# EAGLE design magarray-halleffect-v3r0 (EAGLE 8.5.1)
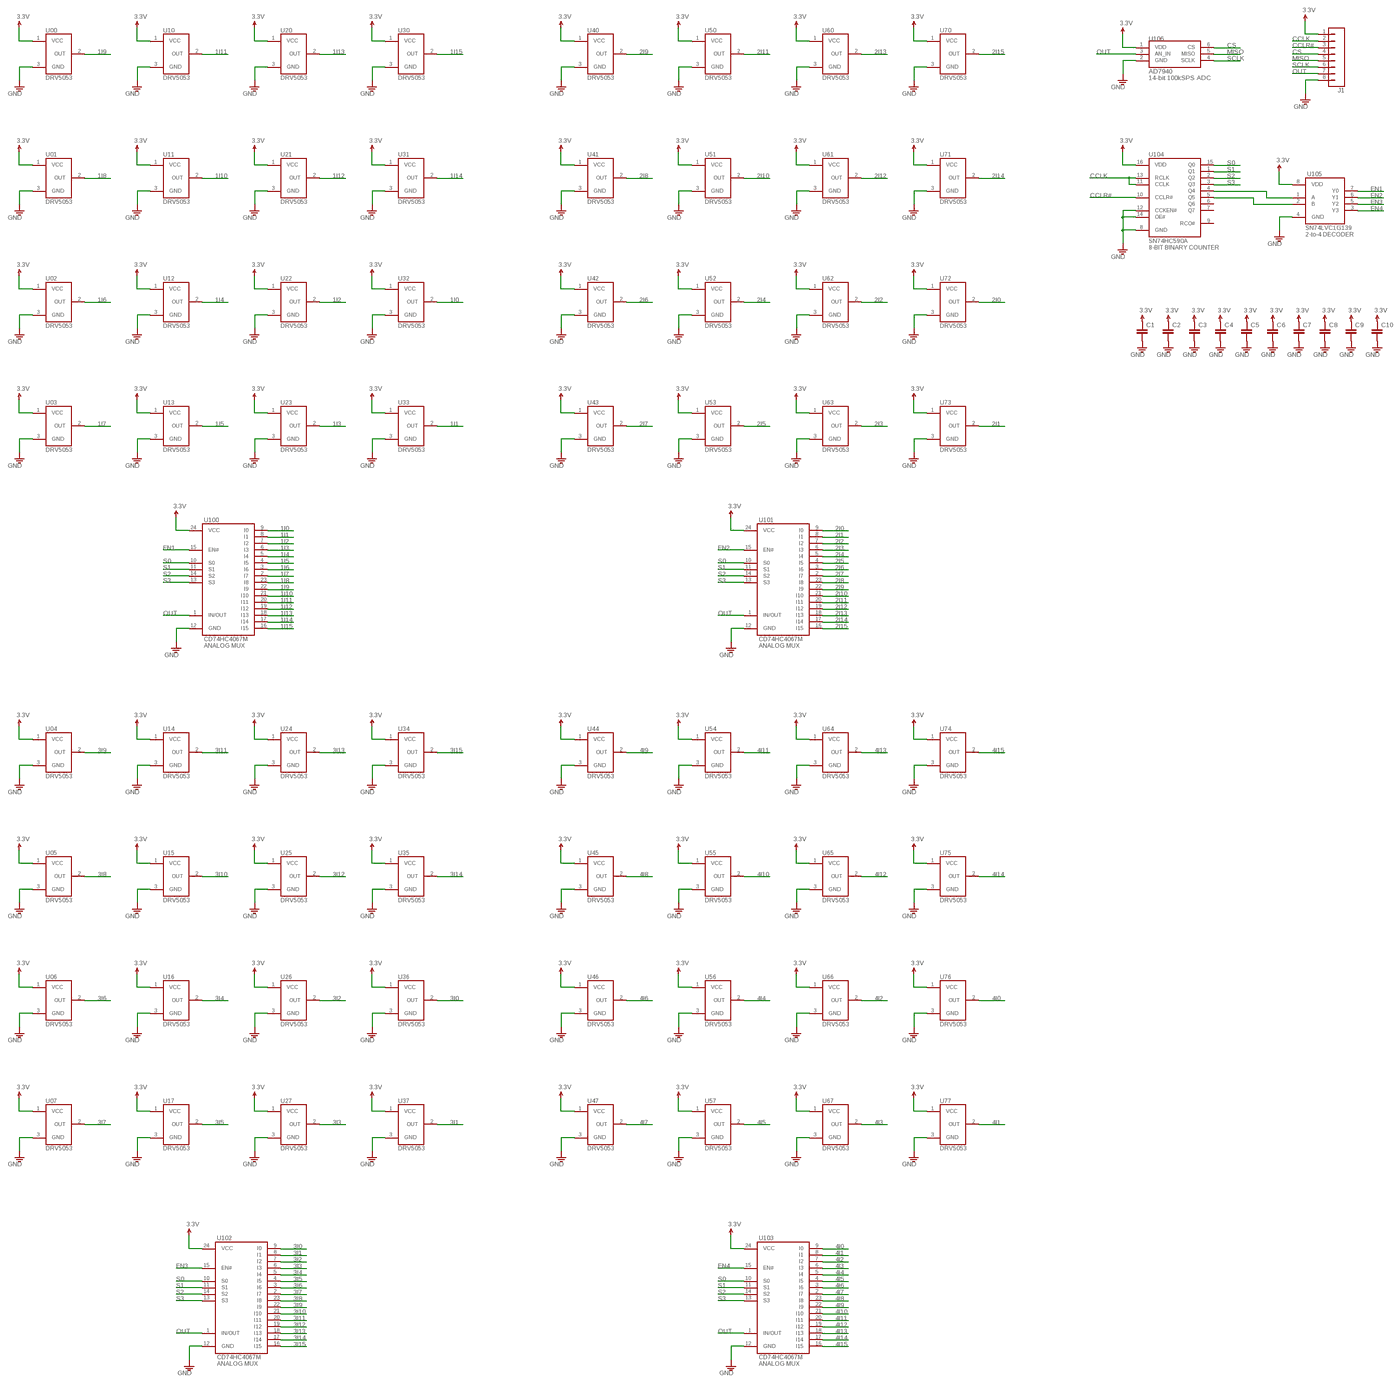
[diagram p0: schematic, sheet 1, overview]
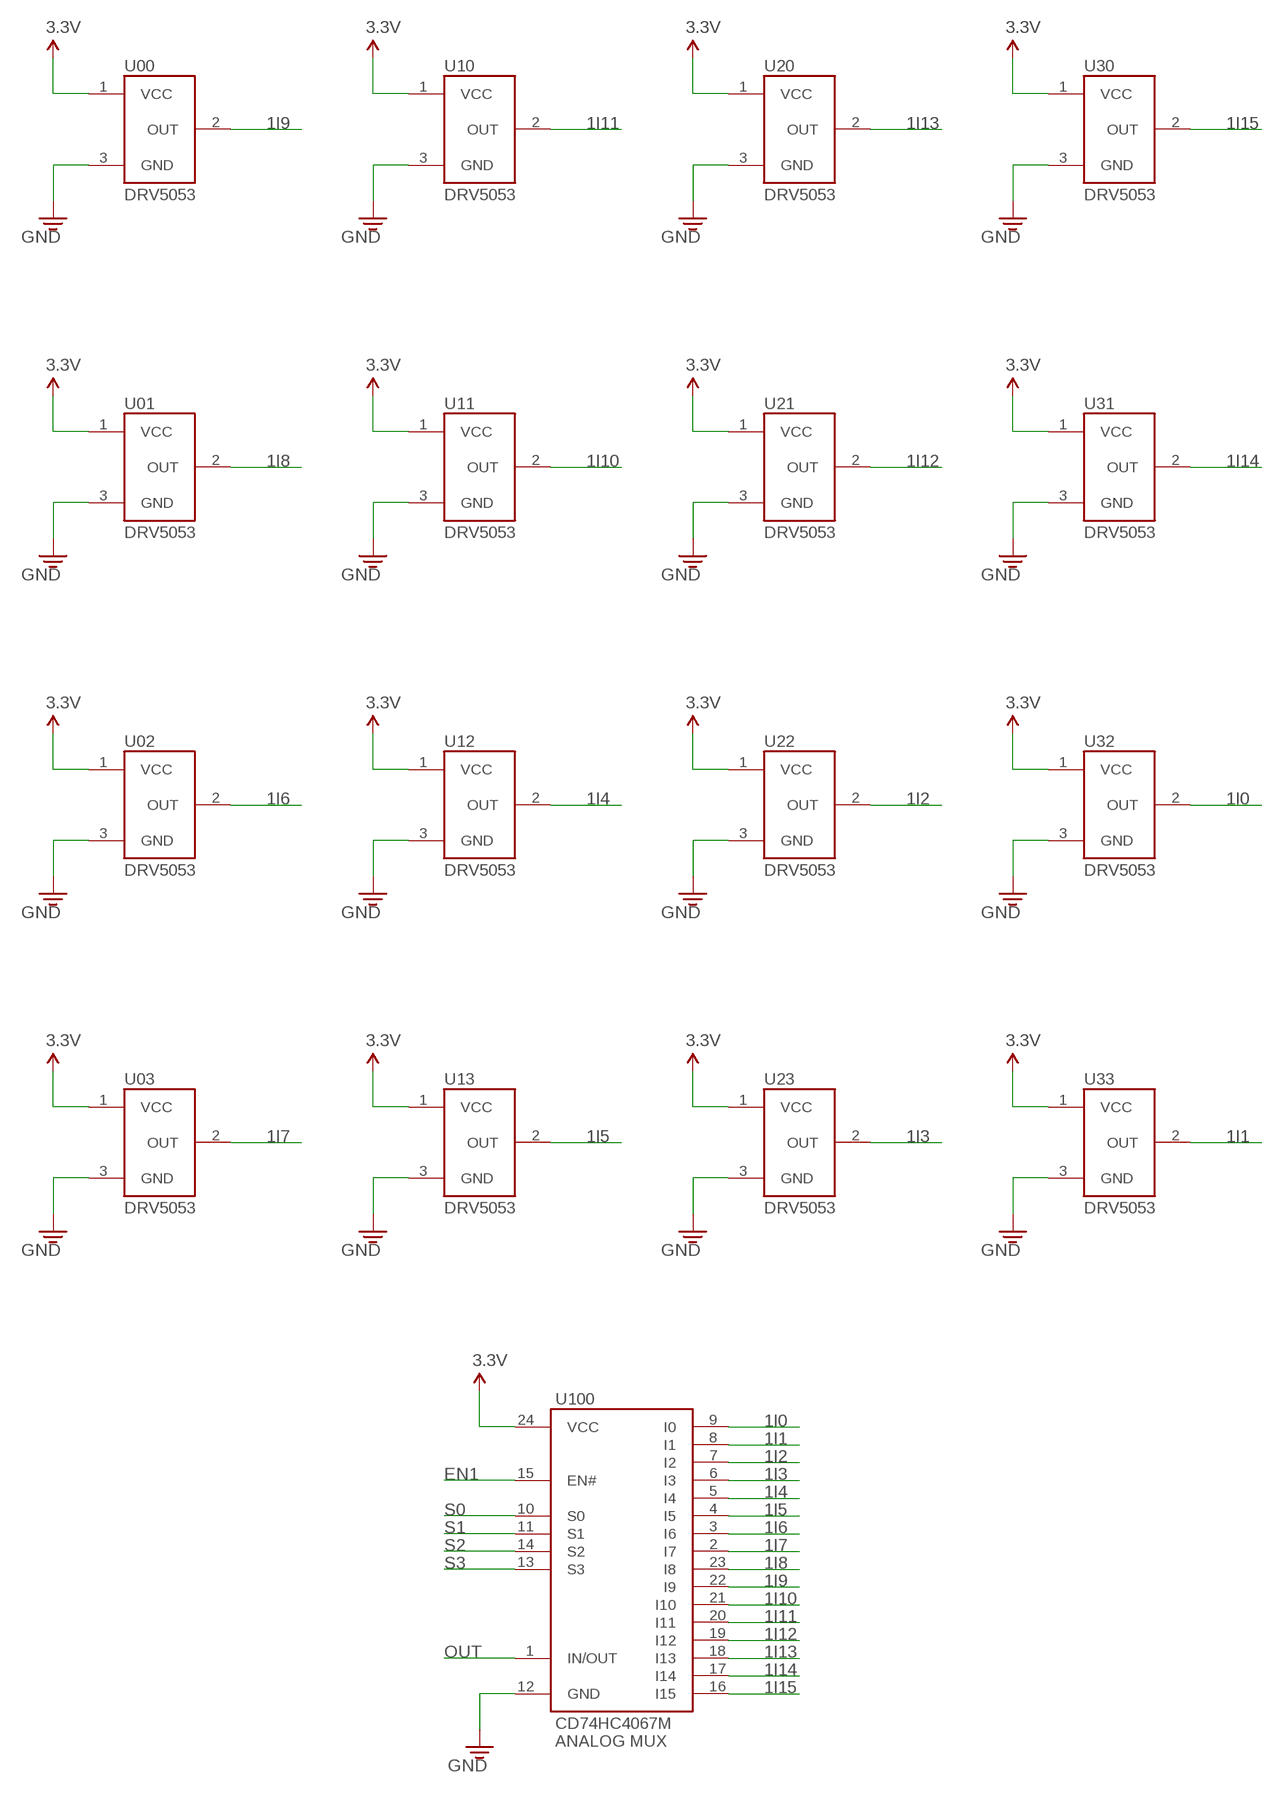
[diagram p1: schematic, sheet 1, part 1 of 4]
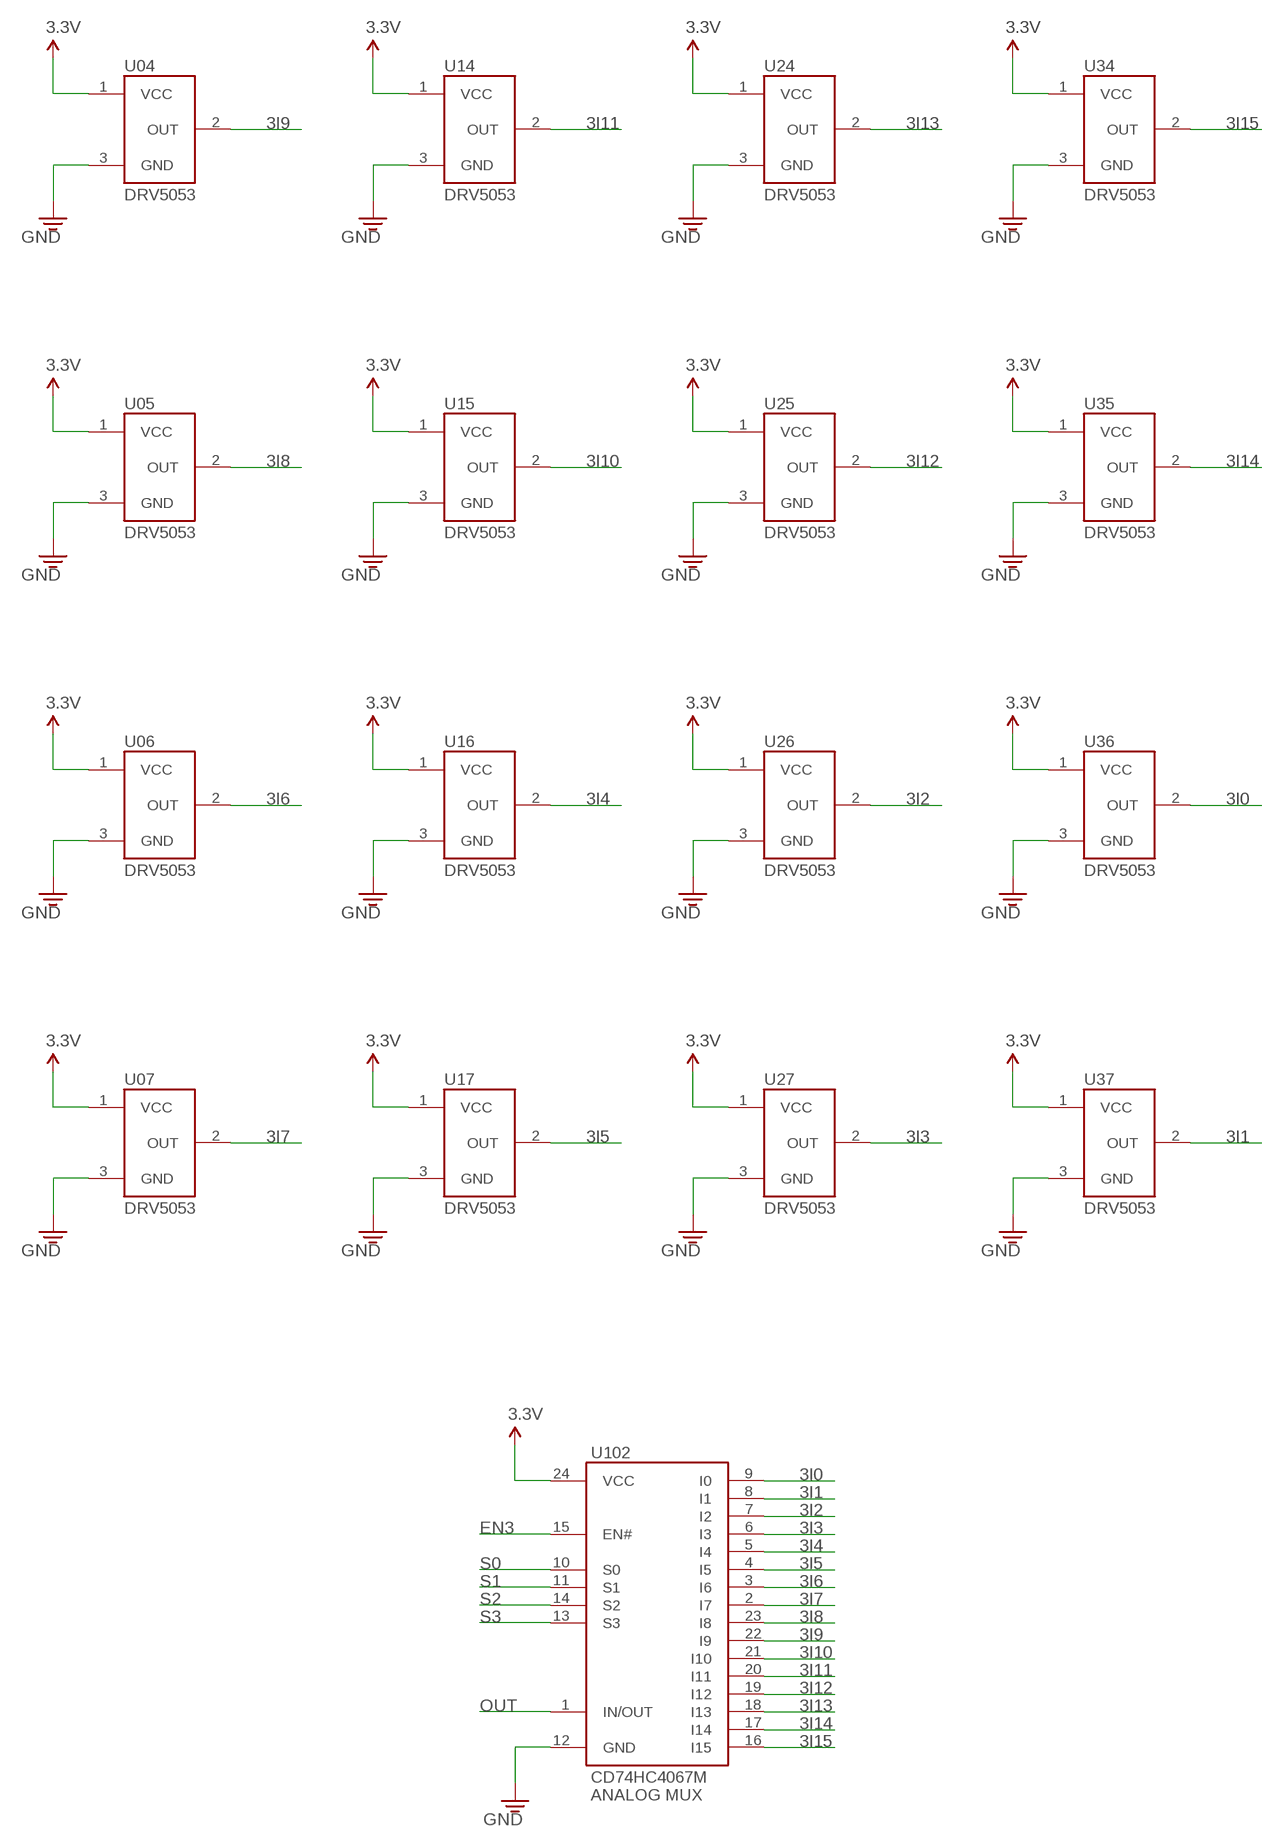
[diagram p2: schematic, sheet 1, part 2 of 4]
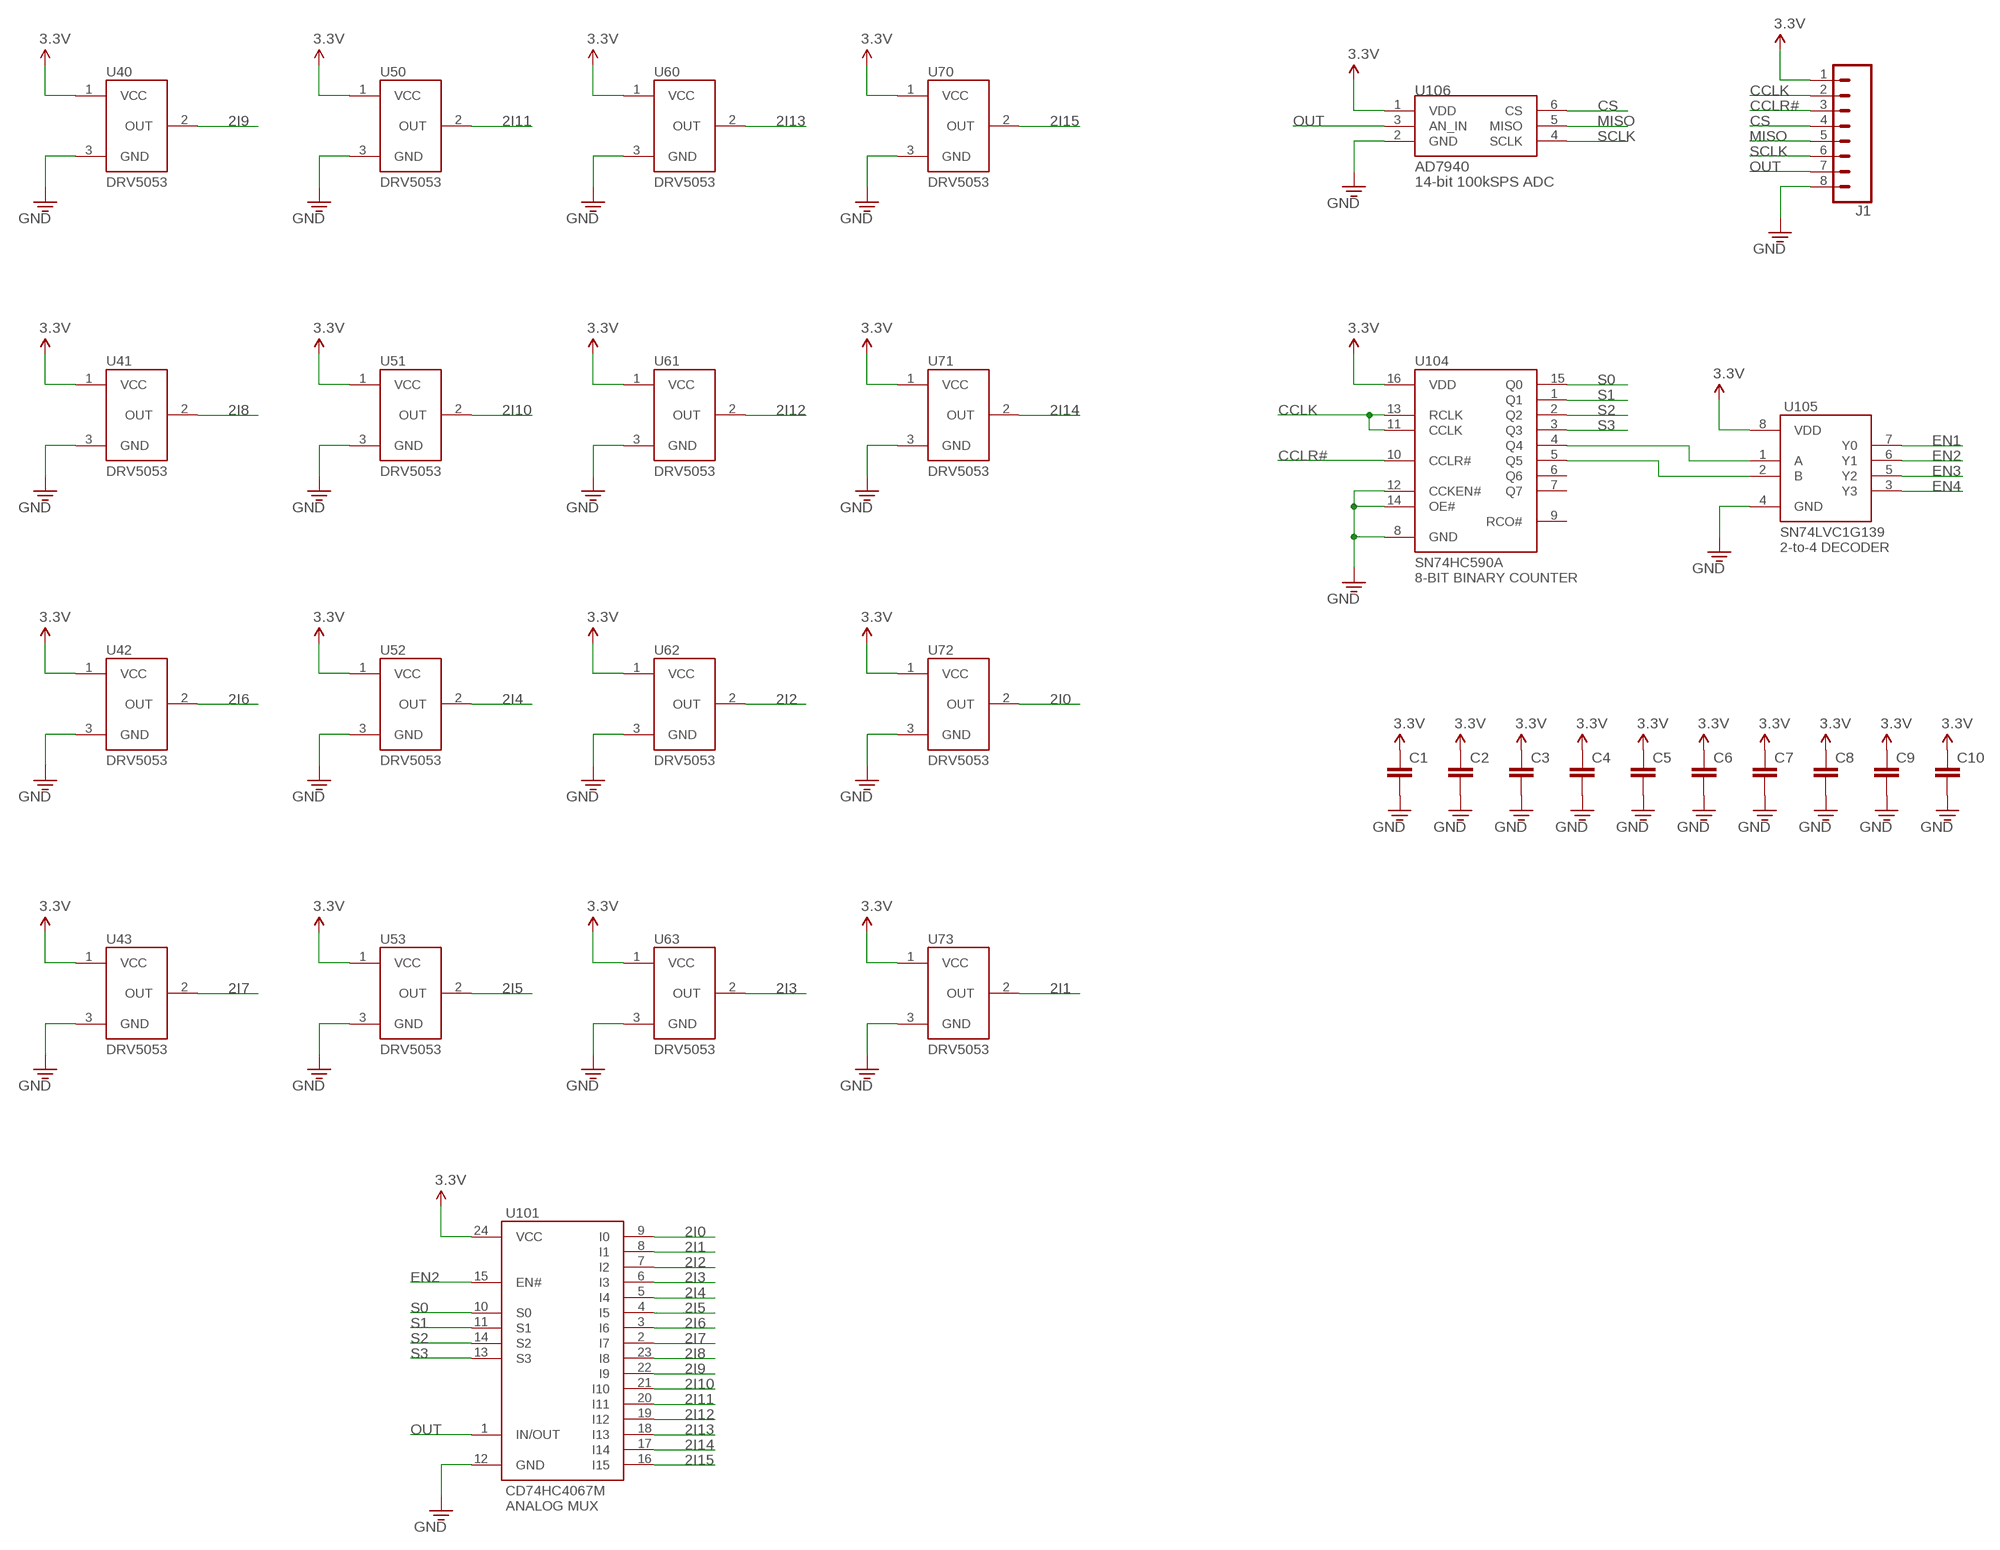
[diagram p3: schematic, sheet 1, part 3 of 4]
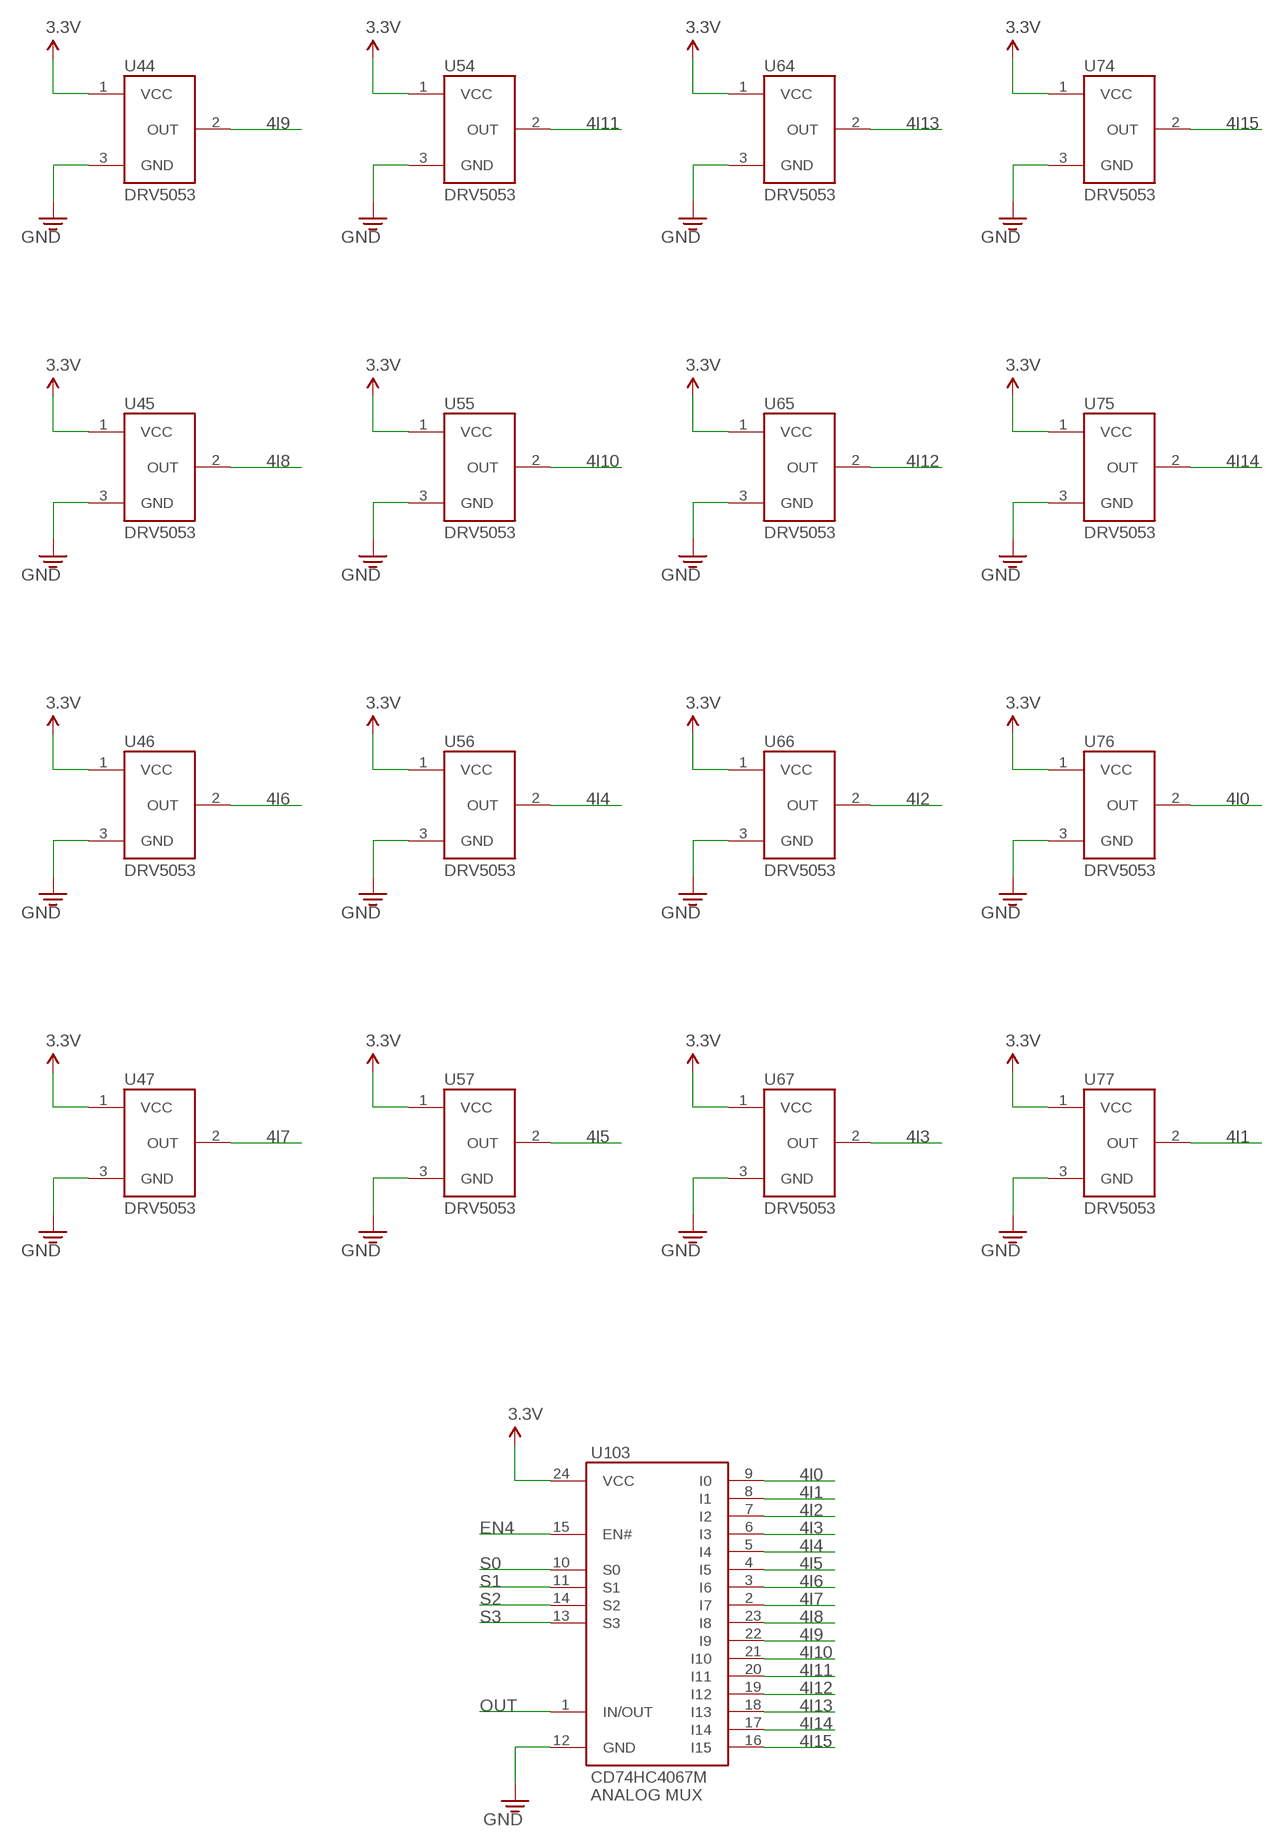
[diagram p4: schematic, sheet 1, part 4 of 4]

## Parts
C1  CAP0603  [0603]
C2  CAP0603  [0603]
C3  CAP0603  [0603]
C4  CAP0603  [0603]
C5  CAP0603  [0603]
C6  CAP0603  [0603]
C7  CAP0603  [0603]
C8  CAP0603  [0603]
C9  CAP0603  [0603]
C10  CAP0603  [0603]
J1  CONN_08LOCK_NO_SILK  [1X08_LOCK_NO_SILK]
U00  DRV5053  [SOT-23]
U01  DRV5053  [SOT-23]
U02  DRV5053  [SOT-23]
U03  DRV5053  [SOT-23]
U04  DRV5053  [SOT-23]
U05  DRV5053  [SOT-23]
U06  DRV5053  [SOT-23]
U07  DRV5053  [SOT-23]
U10  DRV5053  [SOT-23]
U11  DRV5053  [SOT-23]
U12  DRV5053  [SOT-23]
U13  DRV5053  [SOT-23]
U14  DRV5053  [SOT-23]
U15  DRV5053  [SOT-23]
U16  DRV5053  [SOT-23]
U17  DRV5053  [SOT-23]
U20  DRV5053  [SOT-23]
U21  DRV5053  [SOT-23]
U22  DRV5053  [SOT-23]
U23  DRV5053  [SOT-23]
U24  DRV5053  [SOT-23]
U25  DRV5053  [SOT-23]
U26  DRV5053  [SOT-23]
U27  DRV5053  [SOT-23]
U30  DRV5053  [SOT-23]
U31  DRV5053  [SOT-23]
U32  DRV5053  [SOT-23]
U33  DRV5053  [SOT-23]
U34  DRV5053  [SOT-23]
U35  DRV5053  [SOT-23]
U36  DRV5053  [SOT-23]
U37  DRV5053  [SOT-23]
U40  DRV5053  [SOT-23]
U41  DRV5053  [SOT-23]
U42  DRV5053  [SOT-23]
U43  DRV5053  [SOT-23]
U44  DRV5053  [SOT-23]
U45  DRV5053  [SOT-23]
U46  DRV5053  [SOT-23]
U47  DRV5053  [SOT-23]
U50  DRV5053  [SOT-23]
U51  DRV5053  [SOT-23]
U52  DRV5053  [SOT-23]
U53  DRV5053  [SOT-23]
U54  DRV5053  [SOT-23]
U55  DRV5053  [SOT-23]
U56  DRV5053  [SOT-23]
U57  DRV5053  [SOT-23]
U60  DRV5053  [SOT-23]
U61  DRV5053  [SOT-23]
U62  DRV5053  [SOT-23]
U63  DRV5053  [SOT-23]
U64  DRV5053  [SOT-23]
U65  DRV5053  [SOT-23]
U66  DRV5053  [SOT-23]
U67  DRV5053  [SOT-23]
U70  DRV5053  [SOT-23]
U71  DRV5053  [SOT-23]
U72  DRV5053  [SOT-23]
U73  DRV5053  [SOT-23]
U74  DRV5053  [SOT-23]
U75  DRV5053  [SOT-23]
U76  DRV5053  [SOT-23]
U77  DRV5053  [SOT-23]
U100  CD74HC4067M  [SOIC-24]
U101  CD74HC4067M  [SOIC-24]
U102  CD74HC4067M  [SOIC-24]
U103  CD74HC4067M  [SOIC-24]
U104  SN74HC509A  [SO16]
U105  SN74LVC1G139  [SM8]
U106  AD7940  [SOT-23-6L]

## Nets
1I0: U32.2(OUT) U100.9(I0)
1I1: U33.2(OUT) U100.8(I1)
1I2: U22.2(OUT) U100.7(I2)
1I3: U23.2(OUT) U100.6(I3)
1I4: U12.2(OUT) U100.5(I4)
1I5: U13.2(OUT) U100.4(I5)
1I6: U02.2(OUT) U100.3(I6)
1I7: U03.2(OUT) U100.2(I7)
1I8: U01.2(OUT) U100.23(I8)
1I9: U00.2(OUT) U100.22(I9)
1I10: U11.2(OUT) U100.21(I10)
1I11: U10.2(OUT) U100.20(I11)
1I12: U21.2(OUT) U100.19(I12)
1I13: U20.2(OUT) U100.18(I13)
1I14: U31.2(OUT) U100.17(I14)
1I15: U30.2(OUT) U100.16(I15)
2I0: U72.2(OUT) U101.9(I0)
2I1: U73.2(OUT) U101.8(I1)
2I2: U62.2(OUT) U101.7(I2)
2I3: U63.2(OUT) U101.6(I3)
2I4: U52.2(OUT) U101.5(I4)
2I5: U53.2(OUT) U101.4(I5)
2I6: U42.2(OUT) U101.3(I6)
2I7: U43.2(OUT) U101.2(I7)
2I8: U41.2(OUT) U101.23(I8)
2I9: U40.2(OUT) U101.22(I9)
2I10: U51.2(OUT) U101.21(I10)
2I11: U50.2(OUT) U101.20(I11)
2I12: U61.2(OUT) U101.19(I12)
2I13: U60.2(OUT) U101.18(I13)
2I14: U71.2(OUT) U101.17(I14)
2I15: U70.2(OUT) U101.16(I15)
3.3V: C1.1 C2.1 C3.1 C4.1 C5.1 C6.1 C7.1 C8.1 C9.1 C10.1 J1.1 U00.1(VCC) U01.1(VCC) U02.1(VCC) U03.1(VCC) U04.1(VCC) U05.1(VCC) U06.1(VCC) U07.1(VCC) U10.1(VCC) U11.1(VCC) U12.1(VCC) U13.1(VCC) U14.1(VCC) U15.1(VCC) U16.1(VCC) U17.1(VCC) U20.1(VCC) U21.1(VCC) U22.1(VCC) U23.1(VCC) U24.1(VCC) U25.1(VCC) U26.1(VCC) U27.1(VCC) U30.1(VCC) U31.1(VCC) U32.1(VCC) U33.1(VCC) U34.1(VCC) U35.1(VCC) U36.1(VCC) U37.1(VCC) U40.1(VCC) U41.1(VCC) U42.1(VCC) U43.1(VCC) U44.1(VCC) U45.1(VCC) U46.1(VCC) U47.1(VCC) U50.1(VCC) U51.1(VCC) U52.1(VCC) U53.1(VCC) U54.1(VCC) U55.1(VCC) U56.1(VCC) U57.1(VCC) U60.1(VCC) U61.1(VCC) U62.1(VCC) U63.1(VCC) U64.1(VCC) U65.1(VCC) U66.1(VCC) U67.1(VCC) U70.1(VCC) U71.1(VCC) U72.1(VCC) U73.1(VCC) U74.1(VCC) U75.1(VCC) U76.1(VCC) U77.1(VCC) U100.24(VCC) U101.24(VCC) U102.24(VCC) U103.24(VCC) U104.16(VDD) U105.8(VDD) U106.1(VDD)
3I0: U36.2(OUT) U102.9(I0)
3I1: U37.2(OUT) U102.8(I1)
3I2: U26.2(OUT) U102.7(I2)
3I3: U27.2(OUT) U102.6(I3)
3I4: U16.2(OUT) U102.5(I4)
3I5: U17.2(OUT) U102.4(I5)
3I6: U06.2(OUT) U102.3(I6)
3I7: U07.2(OUT) U102.2(I7)
3I8: U05.2(OUT) U102.23(I8)
3I9: U04.2(OUT) U102.22(I9)
3I10: U15.2(OUT) U102.21(I10)
3I11: U14.2(OUT) U102.20(I11)
3I12: U25.2(OUT) U102.19(I12)
3I13: U24.2(OUT) U102.18(I13)
3I14: U35.2(OUT) U102.17(I14)
3I15: U34.2(OUT) U102.16(I15)
4I0: U76.2(OUT) U103.9(I0)
4I1: U77.2(OUT) U103.8(I1)
4I2: U66.2(OUT) U103.7(I2)
4I3: U67.2(OUT) U103.6(I3)
4I4: U56.2(OUT) U103.5(I4)
4I5: U57.2(OUT) U103.4(I5)
4I6: U46.2(OUT) U103.3(I6)
4I7: U47.2(OUT) U103.2(I7)
4I8: U45.2(OUT) U103.23(I8)
4I9: U44.2(OUT) U103.22(I9)
4I10: U55.2(OUT) U103.21(I10)
4I11: U54.2(OUT) U103.20(I11)
4I12: U65.2(OUT) U103.19(I12)
4I13: U64.2(OUT) U103.18(I13)
4I14: U75.2(OUT) U103.17(I14)
4I15: U74.2(OUT) U103.16(I15)
CCLK: J1.2 U104.11(CCLK) U104.13(RCLK)
CCLR#: J1.3 U104.10(CCLR#)
CS: J1.4 U106.6(CS)
EN1: U100.15(EN#) U105.7(Y0)
EN2: U101.15(EN#) U105.6(Y1)
EN3: U102.15(EN#) U105.5(Y2)
EN4: U103.15(EN#) U105.3(Y3)
GND: C1.2 C2.2 C3.2 C4.2 C5.2 C6.2 C7.2 C8.2 C9.2 C10.2 J1.8 U00.3(GND) U01.3(GND) U02.3(GND) U03.3(GND) U04.3(GND) U05.3(GND) U06.3(GND) U07.3(GND) U10.3(GND) U11.3(GND) U12.3(GND) U13.3(GND) U14.3(GND) U15.3(GND) U16.3(GND) U17.3(GND) U20.3(GND) U21.3(GND) U22.3(GND) U23.3(GND) U24.3(GND) U25.3(GND) U26.3(GND) U27.3(GND) U30.3(GND) U31.3(GND) U32.3(GND) U33.3(GND) U34.3(GND) U35.3(GND) U36.3(GND) U37.3(GND) U40.3(GND) U41.3(GND) U42.3(GND) U43.3(GND) U44.3(GND) U45.3(GND) U46.3(GND) U47.3(GND) U50.3(GND) U51.3(GND) U52.3(GND) U53.3(GND) U54.3(GND) U55.3(GND) U56.3(GND) U57.3(GND) U60.3(GND) U61.3(GND) U62.3(GND) U63.3(GND) U64.3(GND) U65.3(GND) U66.3(GND) U67.3(GND) U70.3(GND) U71.3(GND) U72.3(GND) U73.3(GND) U74.3(GND) U75.3(GND) U76.3(GND) U77.3(GND) U100.12(GND) U101.12(GND) U102.12(GND) U103.12(GND) U104.8(GND) U104.12(CCKEN#) U104.14(OE#) U105.4(GND) U106.2(GND)
MISO: J1.5 U106.5(MISO)
N$7: U104.4(Q4) U105.1(A)
N$8: U104.5(Q5) U105.2(B)
OUT: J1.7 U100.1(IN/OUT) U101.1(IN/OUT) U102.1(IN/OUT) U103.1(IN/OUT) U106.3(AN_IN)
S0: U100.10(S0) U101.10(S0) U102.10(S0) U103.10(S0) U104.15(Q0)
S1: U100.11(S1) U101.11(S1) U102.11(S1) U103.11(S1) U104.1(Q1)
S2: U100.14(S2) U101.14(S2) U102.14(S2) U103.14(S2) U104.2(Q2)
S3: U100.13(S3) U101.13(S3) U102.13(S3) U103.13(S3) U104.3(Q3)
SCLK: J1.6 U106.4(SCLK)
Unconnected: U104.6(Q6) U104.7(Q7) U104.9(RCO#)

## Library data of the parts
C1-C10 = magneticimagertile:CAP: Capacitor Standard 0603 ceramic capacitor, and 0.1" leaded capacitor.
J1 = SparkFun-Connectors:CONN_08: Multi connection point. Often used as Generic Header-pin footprint for 0.1 inch spaced/style header connections On any of the 0.1 inch spaced packages, you can populate with these: Break Away Headers - Straight <https://www.sparkfun.com/products/116> (PRT-00116) Break Away Male Headers - Right Angle <https://www.sparkfun.com/products/553> (PRT-00553) Female Headers <https://www.sparkfun.com/products/115> (PRT-00115) Break Away Headers - Machine Pin <https://www.sparkfun.com/products/117> (PRT-00117) Break Away Female Headers - Swiss Machine Pin <https://www.sparkfun.com/products/743> (PRT-00743) Arduino Stackable Header - 8 Pin <https://www.sparkfun.com/products/9279> (PRT-09279) For SCREWTERMINALS and SPRING TERMINALS visit here: Screw Terimnals on SparkFun.com <https://www.sparkfun.com/search/results?term=Screw+Terminals> (5mm/3.5mm/2.54mm spacing) This device is also useful as a general connection point to wire up your design to another part of your project. Our various solder wires solder well into these plated through hole pads. Hook-Up Wire - Assortment (Stranded, 22 AWG) <https://www.sparkfun.com/products/11375> (PRT-11375) Hook-Up Wire - Assortment (Solid Core, 22 AWG) <https://www.sparkfun.com/products/11367> (PRT-11367) View the entire wire category on our website here <https://www.sparkfun.com/categories/141> Special notes: Molex polarized connector foot print use with SKU : PRT-08231 with associated crimp pins and housings. 1MM SMD Version SKU: PRT-10208 NOTES ON THE VARIANTS LOCK and LOCK_LONGPADS... This footprint was designed to help hold the alignment of a through-hole component (i.e. 6-pin header) while soldering it into place. You may notice that each hole has been shifted either up or down by 0.005 of an inch from it's more standard position (which is a perfectly straight line). This slight alteration caused the pins (the squares in the middle) to touch the edges of the holes. Because they are alternating, it causes a "brace" to hold the component in place. 0.005 has proven to be the perfect amount of "off-center" position when using our standard breakaway headers. Although looks a little odd when you look at the bare footprint, once you have a header in there, the alteration is very hard to notice. Also,if you push a header all the way into place, it is covered up entirely on the bottom side.
U00 U01-U07 U10-U17 U20-U27 U30-U37 U40-U47 U50-U57 U60-U67 U70-U77 = magneticimagertile:DRV5053: TI DRV5053 Hall Effect Magnetic Field Sensor with Analog Output
U100-U103 = magneticimagertile:CD74HC4067M: TI CD74HC4067M 16-Channel Analog Multiplexer/Demultiplexer
U104 = magneticimagertile:SN74HC509A: SN74HC509A 8-bit Binary Counter, 2-6V operation
U105 = magneticimagertile:SN74LVC1G139: SN74LVC1G139 2-to-4 Line Decoder, 1.65-5.5V operation
U106 = magneticimagertile:AD7940: Analog Devices AD7940BRJZ 14-bit ADC, 100k Samples/sec sample rate, 2.5-5V single supply

## Board
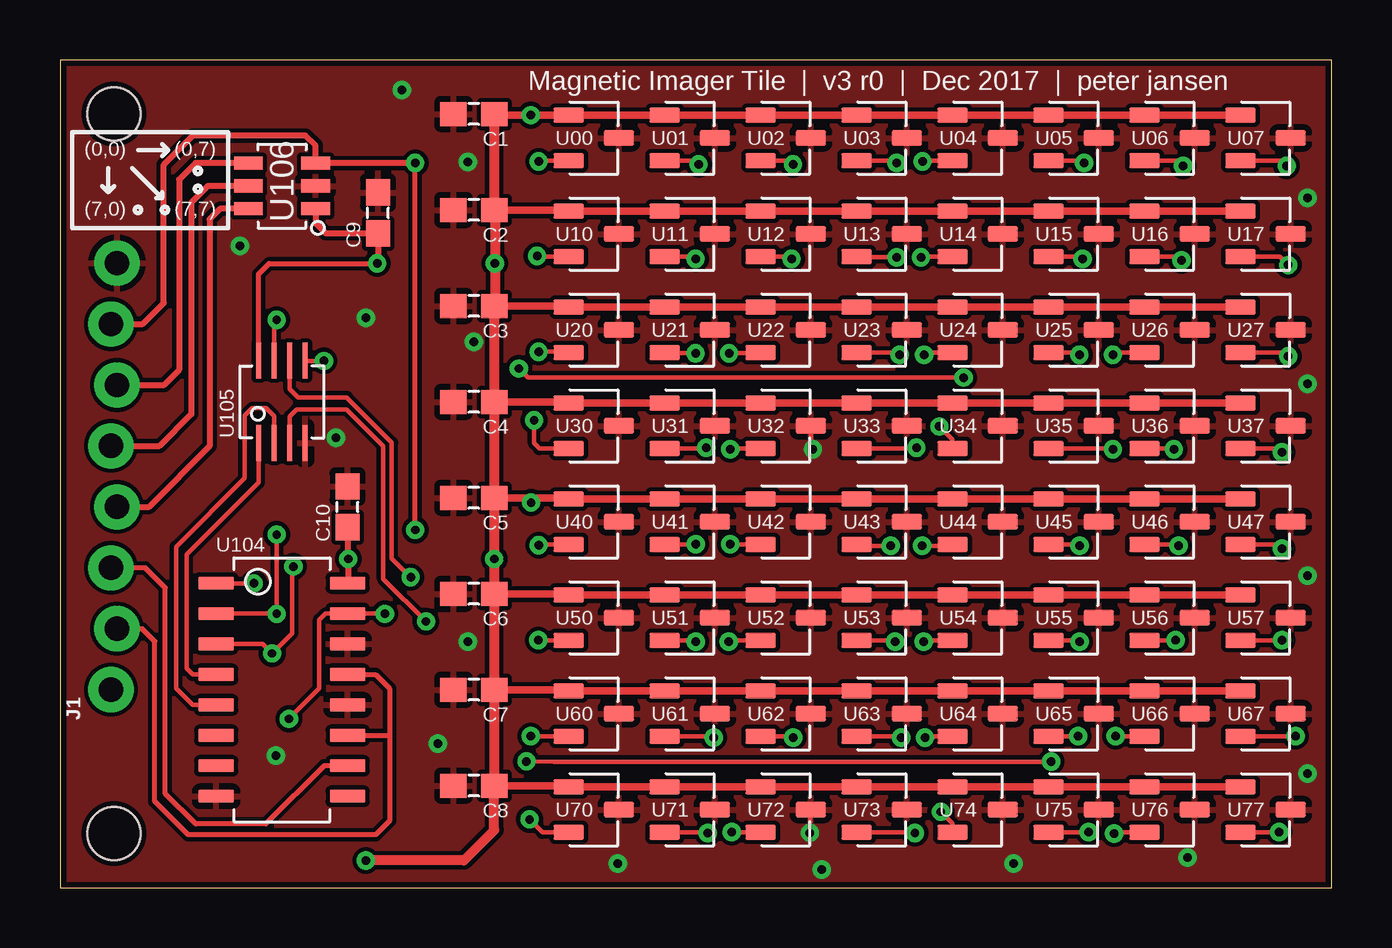
[diagram p5: board, top side]
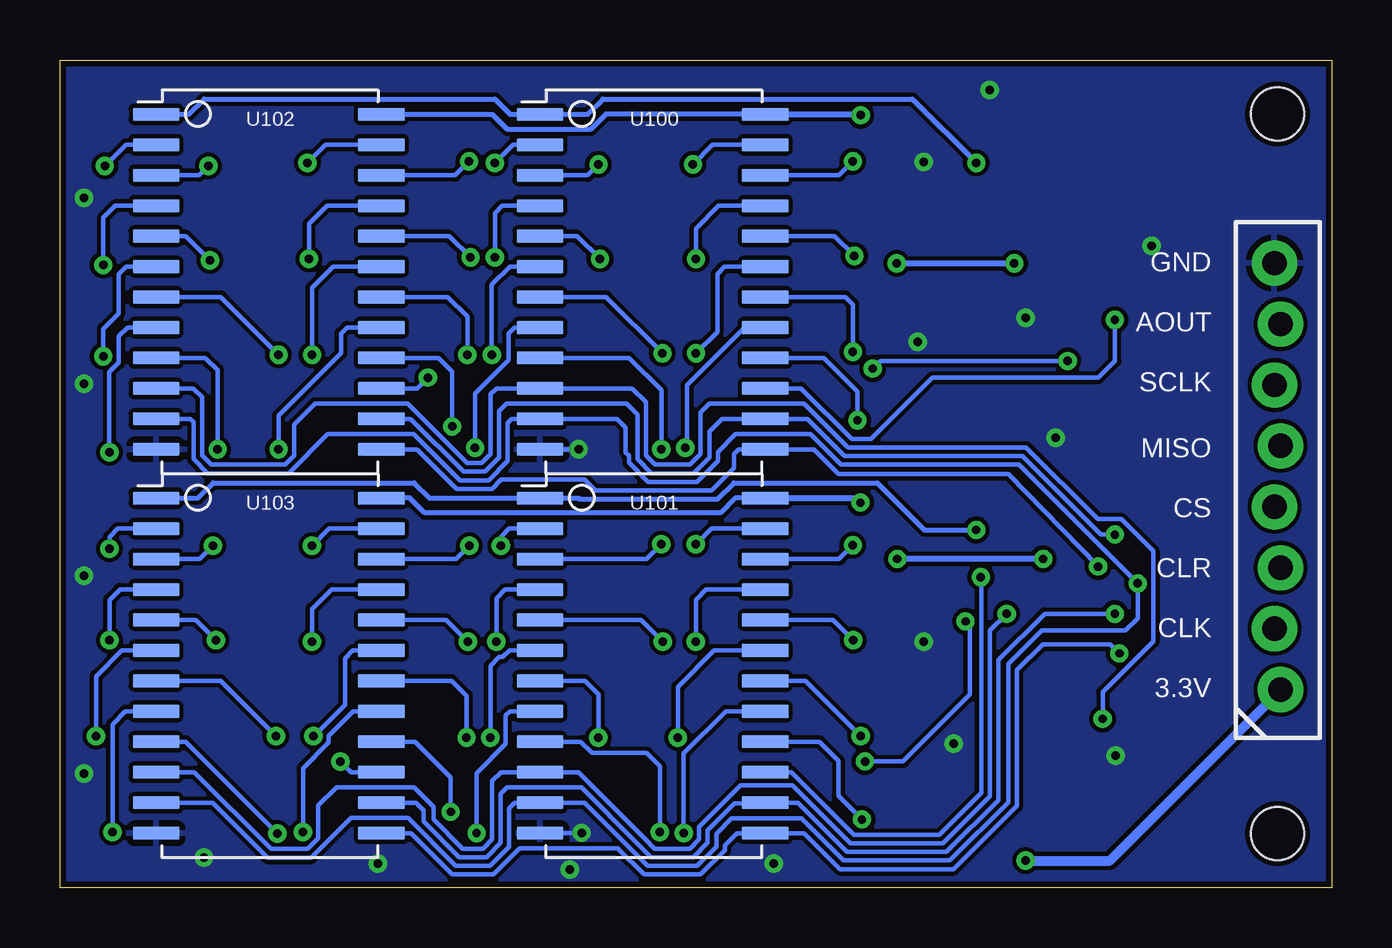
[diagram p6: board, bottom side, seen from below]

Size 53 x 34.5 mm. Coordinates in mm from the lower left corner, seen from the top.
Outline: 0,0 53,0 53,34.5 0,34.5 0,0
Copper layers (1*16): Top 0.035mm / dielectric 1.5mm / Bottom 0.035mm
Design rules "default *": minimum track width 7mil, minimum drill 13mil, track to track 7mil, track to pad 7mil, pad to pad 7mil, via to via 7mil, smd to smd 7mil, copper to edge 10mil, drill to drill 7mil, minimum pad ring 10mil, minimum via ring 8mil, stop-mask expansion 2mil, vias tented up to drill 25mil, thermal gap 10mil
Holes 2.2 mm at 2.25,2.25 2.25,32.25

### Footprints (pad centres in the part's own frame; a part is rotated, then mirrored left to right if it is on the bottom)
0603 = smd 1.1 x 1: 1 -0.85,0; 2 0.85,0
1X08_LOCK_NO_SILK = drill 1.016 pad 1.88: 1 0,0.127; 2 2.54,-0.127; 3 5.08,0.127; 4 7.62,-0.127; 5 10.16,0.127; 6 12.7,-0.127; 7 15.24,0.127; 8 17.78,-0.127
SOT-23 = smd 1.27 x 0.635: 1 -1.05,0.95; 2 -1.05,-0.95; 3 1.05,0
SOIC-24 = smd 0.55 x 1.95: 1 -6.985,-4.745; 2 -5.715,-4.745; 3 -4.445,-4.745; 4 -3.175,-4.745; 5 -1.905,-4.745; 6 -0.635,-4.745; 7 0.635,-4.745; 8 1.905,-4.745; 9 3.175,-4.745; 10 4.445,-4.745; 11 5.715,-4.745; 12 6.985,-4.745; 13 6.985,4.645; 14 5.715,4.645; 15 4.445,4.645; 16 3.175,4.645; 17 1.905,4.645; 18 0.635,4.645; 19 -0.635,4.645; 20 -1.905,4.645; 21 -3.175,4.645; 22 -4.445,4.645; 23 -5.715,4.645; 24 -6.985,4.645
SO16 = smd 0.55 x 1.5: 1 -4.445,-2.74; 2 -3.175,-2.74; 3 -1.905,-2.74; 4 -0.635,-2.74; 5 0.635,-2.74; 6 1.905,-2.74; 7 3.175,-2.74; 8 4.445,-2.74; 9 4.445,2.74; 10 3.175,2.74; 11 1.905,2.74; 12 0.635,2.74; 13 -0.635,2.74; 14 -1.905,2.74; 15 -3.175,2.74; 16 -4.445,2.74
SM8 = smd 0.25 x 1.5: 1 -0.975,-1.725; 2 -0.325,-1.725; 3 0.325,-1.725; 4 0.975,-1.725; 5 0.975,1.725; 6 0.325,1.725; 7 -0.325,1.725; 8 -0.975,1.725
SOT-23-6L = smd 0.55 x 1.2: 1 -0.95,-1.4; 2 0,-1.4; 3 0.95,-1.4; 4 0.95,1.4; 5 0,1.4; 6 -0.95,1.4

### Placement (x,y rotation side)
C1  17.25,32.25 180 top
C2  17.25,28.25 180 top
C3  17.25,24.25 180 top
C4  17.25,20.25 180 top
C5  17.25,16.25 180 top
C6  17.25,12.25 180 top
C7  17.25,8.25 180 top
C8  17.25,4.25 180 top
C9  13.25,28.12 90 top
C10  11.98,15.87 90 top
J1  2.25,8.25 90 top
U00  22.25,31.25 0 top
U01  26.25,31.25 0 top
U02  30.25,31.25 0 top
U03  34.25,31.25 0 top
U04  38.25,31.25 0 top
U05  42.25,31.25 0 top
U06  46.25,31.25 0 top
U07  50.25,31.25 0 top
U10  22.25,27.25 0 top
U11  26.25,27.25 0 top
U12  30.25,27.25 0 top
U13  34.25,27.25 0 top
U14  38.25,27.25 0 top
U15  42.25,27.25 0 top
U16  46.25,27.25 0 top
U17  50.25,27.25 0 top
U20  22.25,23.25 0 top
U21  26.25,23.25 0 top
U22  30.25,23.25 0 top
U23  34.25,23.25 0 top
U24  38.25,23.25 0 top
U25  42.25,23.25 0 top
U26  46.25,23.25 0 top
U27  50.25,23.25 0 top
U30  22.25,19.25 0 top
U31  26.25,19.25 0 top
U32  30.25,19.25 0 top
U33  34.25,19.25 0 top
U34  38.25,19.25 0 top
U35  42.25,19.25 0 top
U36  46.25,19.25 0 top
U37  50.25,19.25 0 top
U40  22.25,15.25 0 top
U41  26.25,15.25 0 top
U42  30.25,15.25 0 top
U43  34.25,15.25 0 top
U44  38.25,15.25 0 top
U45  42.25,15.25 0 top
U46  46.25,15.25 0 top
U47  50.25,15.25 0 top
U50  22.25,11.25 0 top
U51  26.25,11.25 0 top
U52  30.25,11.25 0 top
U53  34.25,11.25 0 top
U54  38.25,11.25 0 top
U55  42.25,11.25 0 top
U56  46.25,11.25 0 top
U57  50.25,11.25 0 top
U60  22.25,7.25 0 top
U61  26.25,7.25 0 top
U62  30.25,7.25 0 top
U63  34.25,7.25 0 top
U64  38.25,7.25 0 top
U65  42.25,7.25 0 top
U66  46.25,7.25 0 top
U67  50.25,7.25 0 top
U70  22.25,3.25 0 top
U71  26.25,3.25 0 top
U72  30.25,3.25 0 top
U73  34.25,3.25 0 top
U74  38.25,3.25 0 top
U75  42.25,3.25 0 top
U76  46.25,3.25 0 top
U77  50.25,3.25 0 top
U100  28.25,25.25 270 bottom
U101  28.25,9.25 270 bottom
U102  44.25,25.25 270 bottom
U103  44.25,9.25 270 bottom
U104  9.25,8.25 270 top
U105  9.25,20.25 0 top
U106  9.25,29.25 90 top

### Tracks (layer width: path | path; a pad name or v marks a point on that pad's centre or on a via)
1I0  (via drill 0.35)
  Top 0.178: U32.2 28.09,18.3 v27.94,18.27
  Bottom 0.178: v27.94,18.27 27.94,20.73 29.29,22.08 U100.9
1I1  (via drill 0.35)
  Top 0.178: U33.2 35.67,18.3 v35.7,18.33
  Bottom 0.178: v35.7,18.33 35.7,20.6 34.3,21.99 34.3,23.1 34.06,23.34 U100.8
1I2  (via drill 0.35)
  Top 0.178: U22.2 29.17,22.27 v27.89,22.27
  Bottom 0.178: v27.89,22.27 30.23,24.62 U100.7
1I3  (via drill 0.35)
  Top 0.178: U23.2 34.91,22.3 v35,22.21
  Bottom 0.178: v35,22.21 35,25.13 34.24,25.89 34.23,25.88 U100.6
1I4  (via drill 0.35)
  Top 0.178: U12.2 30.4,26.3 v30.49,26.21
  Bottom 0.178: v30.49,26.21 31.44,27.16 U100.5
1I5  (via drill 0.35)
  Top 0.178: v34.88,26.27 33.23,26.27 U13.2
  Bottom 0.178: U100.4 34.56,28.42 34.88,28.11 v34.88,26.27
1I6  (via drill 0.35)
  Top 0.178: U02.2 30.4,30.3 v30.56,30.15
  Bottom 0.178: v30.56,30.15 31.01,29.7 U100.3
1I7  (via drill 0.35)
  Top 0.178: U03.2 34.78,30.3 v34.88,30.21
  Bottom 0.178: v34.88,30.21 34.12,30.97 U100.2
1I8  (via drill 0.35)
  Top 0.178: U01.2 26.47,30.3 v26.62,30.15
  Bottom 0.178: v26.62,30.15 25.8,30.97 U100.23
1I9  (via drill 0.35)
  Top 0.178: U00.2 19.98,30.3 v19.95,30.27
  Bottom 0.178: v19.95,30.27 20.53,29.7 U100.22
1I10  (via drill 0.35)
  Top 0.178: U11.2 26.4,26.3 v26.49,26.21
  Bottom 0.178: v26.49,26.21 26.49,27.48 25.55,28.42 U100.21
1I11  (via drill 0.35)
  Top 0.178: U10.2 19.92,26.3 v19.89,26.34
  Bottom 0.178: v19.89,26.34 20.71,27.16 U100.20
1I12  (via drill 0.35)
  Top 0.178: U21.2 25.23,22.27 v26.49,22.27
  Bottom 0.178: v26.49,22.27 25.6,23.16 25.6,25.57 25.29,25.88 U100.19
1I13  (via drill 0.35)
  Top 0.178: U20.2 21.16,22.34 v19.95,22.34
  Bottom 0.178: v19.95,22.34 19.95,24.3 20.26,24.62 U100.18
1I14  (via drill 0.35)
  Top 0.178: 26.91,18.36 v26.94,18.33 26.9,18.3 U31.2
  Bottom 0.178: U100.17 24.47,23.34 26.87,20.94 26.87,18.52 v26.94,18.33
1I15  (via drill 0.35)
  Top 0.178: U30.2 19.99,18.3 19.76,18.52 v19.76,19.48
  Bottom 0.178: v19.76,19.48 19.76,20.68 21.16,22.08 U100.16
2I0  (via drill 0.35)
  Top 0.178: U72.2 29.19,2.31 v28,2.31
  Bottom 0.178: U101.9 31.3,6.07 30.83,5.61 28.54,5.61 28,5.06 v28,2.31
2I1  (via drill 0.35)
  Top 0.178: U73.2 35.61,2.3 v35.64,2.27
  Bottom 0.178: v35.64,2.27 35.64,4.76 34.42,5.98 34.42,7.17 34.24,7.34 U101.8
2I2  (via drill 0.35)
  Top 0.178: U62.2 30.51,6.3 v30.56,6.25
  Bottom 0.178: v30.56,6.25 30.56,8.06 31.12,8.62 32.98,8.62 U101.7
2I3  (via drill 0.35)
  Top 0.178: U63.2 35.08,6.3 v35.06,6.25
  Bottom 0.178: v35.06,6.25 35.06,9.25 34.71,9.6 34.55,9.6 34.27,9.88 U101.6
2I4  (via drill 0.35)
  Top 0.178: U52.2 27.92,10.3 v27.88,10.25
  Bottom 0.178: v27.88,10.25 28.78,11.16 U101.5
2I5  (via drill 0.35)
  Top 0.178: U53.2 34.76,10.3 v34.81,10.25
  Bottom 0.178: v34.81,10.25 34.81,12.06 34.45,12.42 U101.4
2I6  (via drill 0.35)
  Top 0.178: U42.2 v27.95,14.3 v27.94,14.31
  Bottom 0.178: v27.94,14.31 28.55,13.7 U101.3
2I7  (via drill 0.35)
  Top 0.178: U43.2 33.25,14.25 v34.62,14.25
  Bottom 0.178: v34.62,14.25 34.62,14.62 34.28,14.97 U101.2
2I8  (via drill 0.35)
  Top 0.178: U41.2 25.21,14.31 v26.5,14.31
  Bottom 0.178: v26.5,14.31 25.85,14.97 U101.23
2I9  (via drill 0.35)
  Top 0.178: U40.2 19.98,14.3 v19.95,14.27
  Bottom 0.178: v19.95,14.27 20.53,13.7 U101.22
2I10  (via drill 0.35)
  Top 0.178: U51.2 26.45,10.3 v26.5,10.25
  Bottom 0.178: v26.5,10.25 26.5,12 26.08,12.42 U101.21
2I11  (via drill 0.35)
  Top 0.178: U50.2 v19.95,10.3 v19.94,10.31
  Bottom 0.178: v19.94,10.31 20.78,11.16 U101.20
2I12  (via drill 0.35)
  Top 0.178: U61.2 27.2,6.3 v27.25,6.25
  Bottom 0.178: v27.25,6.25 27.25,8.38 25.74,9.88 U101.19
2I13  (via drill 0.35)
  Top 0.178: U60.2 v19.64,6.3 v19.62,6.31
  Bottom 0.178: v19.62,6.31 21.93,8.61 U101.18
2I14  (via drill 0.35)
  Top 0.178: U71.2 26.97,2.3 v27,2.27
  Bottom 0.178: U101.17 25.24,7.34 27,5.59 v27,2.27
2I15  (via drill 0.35)
  Top 0.178: U70.2 20.11,2.3 v19.57,2.84
  Bottom 0.178: U101.16 21.35,6.07 20.56,5.29 20.56,3.82 v19.57,2.84
3.3V  (via drill 0.35)
  Top 0.203: U105.8 8.27,25.58 8.71,26.02 v13.22,26.02
  Top 0.254: U106.1 10.65,27.7 11.08,27.27 C9.1 13.25,26.17 13.22,26.15 v13.22,26.02 | C10.1 12.02,14.98 v12.02,13.7 12.02,12.72 U104.16 | v19.63,16.05 19.63,16.25
  Top 0.305: U07.1 U06.1 U05.1 U04.1 U03.1 U02.1 U01.1 U00.1 v19.62,32.2 18.15,32.2 C1.1 | C2.1 21.15,28.25 U10.1 U11.1 U12.1 U13.1 U14.1 U15.1 U16.1 U17.1 | C3.1 18.12,24.25 21.15,24.25 U20.1 U21.1 U22.1 U23.1 U24.1 U25.1 U26.1 U27.1 | C4.1 21.15,20.25 U30.1 U31.1 U32.1 U33.1 U34.1 U35.1 U36.1 U37.1 | C5.1 19.63,16.25 21.15,16.25 U40.1 U41.1 U42.1 U43.1 U44.1 U45.1 U46.1 U47.1 | C6.1 21.15,12.25 U50.1 U51.1 U52.1 U53.1 U54.1 U55.1 U56.1 U57.1 | C7.1 21.15,8.25 U60.1 U61.1 U62.1 U63.1 U64.1 U65.1 U66.1 U67.1 | C8.1 21.15,4.25 U70.1 U71.1 U72.1 U73.1 U74.1 U75.1 U76.1 U77.1
  Top 0.406: C1.1 C2.1 18.12,28.23 v18.12,26.02 18.12,24.25 | C3.1 C4.1 C5.1 v18.1,13.7 C6.1 C7.1 C8.1 18.1,2.41 18.11,2.4 16.84,1.13 12.88,1.13 12.88,1.12 v12.75,1.12
  Bottom 0.178: U103.24 39.25,16.25 | U100.24 23.62,32.25
  Bottom 0.203: U101.24 24.87,16.23 25.48,15.62 37.8,15.62 38.42,16.25 39.25,16.25 39.59,16.25 | U102.24 34.98,32.23 34.38,31.62 30.88,31.62 30.25,32.25 23.62,32.25
  Bottom 0.254: 23.59,16.25 U101.24 19.82,16.23 v19.63,16.05 | U100.24 19.52,32.23 19.5,32.25 19.58,32.25 v19.62,32.2 | v13.22,26.02 v18.12,26.02 | v12.02,13.7 v18.1,13.7 18.11,13.7
  Bottom 0.406: v12.75,1.12 9.25,1.12 J1.1
3I0  (via drill 0.35)
  Top 0.178: U36.2 46.4,18.3 v46.43,18.27
  Bottom 0.178: v46.43,18.27 46.43,21.57 46.94,22.08 U102.9
3I1  (via drill 0.35)
  Top 0.178: U37.2 50.78,18.3 v50.94,18.14
  Bottom 0.178: U102.8 50.18,23.34 50.55,22.98 50.55,21.88 50.94,21.49 v50.94,18.14
3I2  (via drill 0.35)
  Top 0.178: U26.2 43.98,22.3 v43.89,22.21
  Bottom 0.178: v43.89,22.21 46.3,24.62 U102.7
3I3  (via drill 0.35)
  Top 0.178: U27.2 51.04,22.3 v51.19,22.15
  Bottom 0.178: U102.6 50.25,25.88 50.56,25.57 50.56,23.92 51.19,23.29 v51.19,22.15
3I4  (via drill 0.35)
  Top 0.178: U16.2 46.59,26.3 v46.75,26.15
  Bottom 0.178: v46.75,26.15 47.76,27.16 U102.5
3I5  (via drill 0.35)
  Top 0.178: U17.2 50.85,26.3 v51.19,25.95
  Bottom 0.178: U102.4 50.69,28.42 51.19,27.92 v51.19,25.95
3I6  (via drill 0.35)
  Top 0.178: U06.2 46.59,30.3 v46.81,30.08
  Bottom 0.178: v46.81,30.08 47.2,29.7 U102.3
3I7  (via drill 0.35)
  Top 0.178: U07.2 50.91,30.3 v51.13,30.08
  Bottom 0.178: v51.13,30.08 50.25,30.97 U102.2
3I8  (via drill 0.35)
  Top 0.178: U05.2 42.59,30.3 v42.69,30.21
  Bottom 0.178: v42.69,30.21 41.93,30.97 U102.23
3I9  (via drill 0.35)
  Top 0.178: U04.2 35.98,30.3 v35.95,30.27
  Bottom 0.178: v35.95,30.27 36.53,29.7 U102.22
3I10  (via drill 0.35)
  Top 0.178: U15.2 42.53,26.3 arc-90 v42.62,26.21
  Bottom 0.178: v42.62,26.21 42.62,27.67 41.87,28.42 U102.21
3I11  (via drill 0.35)
  Top 0.178: U14.2 35.92,26.3 v35.89,26.27
  Bottom 0.178: v35.89,26.27 36.77,27.16 U102.20
3I12  (via drill 0.35)
  Top 0.178: U25.2 42.4,22.3 v42.49,22.21
  Bottom 0.178: v42.49,22.21 42.49,25 41.61,25.88 U102.19
3I13  (via drill 0.35)
  Top 0.178: U24.2 36.11,22.3 v36.02,22.21
  Bottom 0.178: U102.18 36.84,24.62 36.02,23.8 v36.02,22.21
3I14  (via drill 0.35)
  Top 0.178: U35.2 43.86,18.3 v43.89,18.27
  Bottom 0.178: v43.89,18.27 43.89,19.67 41.29,22.27 41.29,23.1 41.04,23.34 U102.17
3I15  (via drill 0.35)
  Top 0.178: U34.2 37.2,18.68 v36.65,19.22
  Bottom 0.178: U102.16 37.22,22.08 36.65,21.51 v36.65,19.22
4I0  (via drill 0.35)
  Top 0.178: U76.2 43.99,2.3 v43.94,2.25
  Bottom 0.178: v43.94,2.25 47.76,6.07 U103.9
4I1  (via drill 0.35)
  Top 0.178: U77.2 v50.8,2.3 v50.81,2.31
  Bottom 0.178: v50.81,2.31 50.81,6.81 50.28,7.34 U103.8
4I2  (via drill 0.35)
  Top 0.178: U66.2 44.01,6.3 v44,6.31
  Bottom 0.178: v44,6.31 46.3,8.61 U103.7
4I3  (via drill 0.35)
  Top 0.178: U67.2 51.49,6.3 v51.5,6.31
  Bottom 0.178: v51.5,6.31 51.5,8.81 50.43,9.88 U103.6
4I4  (via drill 0.35)
  Top 0.178: U56.2 45.21,10.31 v46.5,10.31
  Bottom 0.178: v46.5,10.31 47.34,11.16 U103.5
4I5  (via drill 0.35)
  Top 0.178: U57.2 49.21,10.31 v50.94,10.31
  Bottom 0.178: v50.94,10.31 50.94,12 50.5,12.44 49.01,12.44 U103.4
4I6  (via drill 0.35)
  Top 0.178: U46.2 46.58,14.3 v46.62,14.25
  Bottom 0.178: v46.62,14.25 47.18,13.7 U103.3
4I7  (via drill 0.35)
  Top 0.178: U47.2 50.76,14.3 v50.94,14.12
  Bottom 0.178: v50.94,14.12 50.94,14.62 50.6,14.97 U103.2
4I8  (via drill 0.35)
  Top 0.178: U45.2 42.45,14.3 v42.5,14.25
  Bottom 0.178: v42.5,14.25 41.78,14.97 U103.23
4I9  (via drill 0.35)
  Top 0.178: U44.2 37.15,14.25 v35.94,14.25
  Bottom 0.178: v35.94,14.25 36.49,13.7 U103.22
4I10  (via drill 0.35)
  Top 0.178: U55.2 42.45,10.3 v42.5,10.25
  Bottom 0.178: v42.5,10.25 42.5,11.62 41.69,12.44 41.67,12.42 U103.21
4I11  (via drill 0.35)
  Top 0.178: U54.2 36.05,10.3 v36,10.25
  Bottom 0.178: v36,10.25 36.91,11.16 U103.20
4I12  (via drill 0.35)
  Top 0.178: U65.2 42.42,6.3 v42.44,6.31
  Bottom 0.178: v42.44,6.31 41.12,7.62 41.12,9.56 40.8,9.88 U103.19
4I13  (via drill 0.35)
  Top 0.178: U64.2 36.11,6.3 v36.06,6.25
  Bottom 0.178: v36.06,6.25 36.06,8 36.69,8.62 36.7,8.61 U103.18
4I14  (via drill 0.35)
  Top 0.178: v42.88,2.31 41.21,2.31 U75.2
  Bottom 0.178: U103.17 40.78,7.34 41.79,6.33 41.79,6.05 42.88,4.96 v42.88,2.31
4I15  (via drill 0.35)
  Top 0.178: U74.2 37.2,2.67 v36.72,3.16
  Bottom 0.178: U103.16 38.2,6.07 36.72,4.59 v36.72,3.16
CCLK
  Top 0.203: U104.13 13.15,8.89 13.73,8.3 13.73,6.33 | 13.73,6.33 13.73,2.77 13.16,2.2 5.34,2.2 3.95,3.59 3.95,10.27 3.43,10.79 J1.2 | U104.11 13.72,6.34 13.73,6.33
CCLR#
  Top 0.203: U104.10 11.01,5.07 8.58,2.65 5.66,2.65 4.39,3.91 4.39,12.49 3.56,13.33 J1.3
CS
  Top 0.254: J1.4 3.71,15.87 6.24,18.4 6.24,27.86 6.68,28.3 U106.6
EN1  (via drill 0.35)
  Top 0.178: v9.03,23.67 arc-90 8.93,23.71 U105.7
  Bottom 0.178: U100.15 22.1,20.8 20,18.7 19.19,18.7 16.63,21.26 9.73,21.26 9.03,21.95 v9.03,23.67
EN2  (via drill 0.35)
  Top 0.178: v14.62,12.94 13.83,13.72 13.83,18.55 11.95,20.42 11.95,20.43 9.92,20.43 9.57,20.77 U105.6
  Bottom 0.178: U101.15 22.51,4.8 19.9,2.2 16.34,2.2 14.59,3.94 14.59,12.91 v14.62,12.94
EN3  (via drill 0.35)
  Top 0.178: v37.67,21.26 19.51,21.26 v19.13,21.64 | v11,21.95 10.25,21.95 U105.5
  Bottom 0.178: U102.15 38.12,20.8 v37.67,21.26 | v19.13,21.64 18.81,21.95 v11,21.95
EN4  (via drill 0.35)
  Top 0.178: v41.31,5.25 20.56,5.25 v19.44,5.25 | v15.25,11.1 13.48,12.87 13.48,18.4 11.95,19.92 9.86,19.92 9.57,19.64 U105.3
  Bottom 0.178: U103.15 40.87,4.8 v41.31,5.25 | v19.44,5.25 17.86,5.25 15.06,8.05 15.06,10.91 v15.25,11.1
GND  (via drill 0.35)
  Top 0.178: U72.3 31.27,3.22 arc90 31.26,3.21 v31.26,2.28 | v31.38,18.27 31.3,18.35 U32.3
  Bottom 0.178: U101.12 v31.26,2.28 | U100.12 v31.39,18.27 v31.38,18.27
  other vias: 9,5.5 17,10.25 15.75,6 23.25,1 31.75,0.75 39.75,1 47,1.25 52,4.75 52,13 52,21 52,28.75 14.25,33.25 17,30.25 17.25,22.75 12.75,23.75 7.5,26.75 11.5,18.75
  pour Top: 0.25,34.5 0.25,0 53,0 53,34.5
  pour Bottom: 0,34.5 0,0 53,0 53,34.5
MISO
  Top 0.254: J1.5 4.15,18.41 5.47,19.73 5.47,28.56 6.17,29.25 6.18,29.25 U106.5
N$7
  Top 0.178: U104.4 5.53,8.89 5.28,9.13 5.28,13.89 8.27,16.88 U105.1
N$8
  Top 0.178: U104.5 5.53,7.61 4.84,8.3 4.84,14.21 7.7,17.06 7.7,19.67 8.02,19.99 8.59,19.99 8.93,19.65 U105.2
OUT  (via drill 0.35)
  Top 0.203: v14.81,14.91 v14.81,30.21
  Top 0.254: J1.7 3.45,23.49 4.33,24.37 4.33,30.15 5.54,31.35 10.24,31.35 10.65,30.94 U106.3 v14.8,30.2 v14.81,30.21
  Bottom 0.203: U102.1 47.64,32.23 47,32.88 34.88,32.88 34.23,32.23 U100.1 31.02,32.23 30.38,32.88 17.48,32.88 v14.81,30.21 | U103.1 47.27,16.23 46.62,16.88 38.24,16.88 37.6,16.23 U101.1 31.38,16.23 31.34,16.19 25.6,16.19 24.91,16.88 18.94,16.88 16.97,14.91 v14.81,14.91
S0  (via drill 0.35)
  Top 0.178: v13.54,11.41 13.53,11.42 U104.15 11.07,11.42 10.81,11.16 10.81,8.3 v9.54,7.03
  Bottom 0.178: U103.10 47.41,4.8 44.2,1.61 42.67,1.61 42.23,2.05 42.23,3.42 41.48,4.17 38.24,4.17 37.42,3.36 37.42,2.84 36.21,1.62 35.37,1.62 34.99,2 34.99,4.44 34.62,4.81 U101.10 31.39,4.8 28.65,2.06 28.65,2.05 28.22,1.62 26.73,1.62 26.36,2 26.36,2.54 24.63,4.26 22.47,4.26 20.05,1.84 16.19,1.84 14.24,3.79 14.24,10.72 v13.54,11.41 | U102.10 47.45,20.81 47.08,20.44 47.08,18 46.7,17.63 43.62,17.63 43.25,18 43.25,19.3 42.37,20.18 38.52,20.18 36.03,17.69 35.43,17.69 35.06,18.07 35.06,20.57 34.81,20.81 U100.10 29.15,20.8 28.58,20.23 28.58,18 28.2,17.63 26.73,17.63 26.29,18.07 26.29,19.8 25.92,20.18 21.98,20.18 20.15,18.34 12.73,18.34 9.75,15.36 8.76,15.36 7.43,14.03 7.43,10.26 9.54,8.15 v9.54,7.03
S1  (via drill 0.35)
  Top 0.178: v8.08,12.68 6.52,12.68 U104.1
  Bottom 0.178: U103.11 46.64,3.54 44.35,1.25 42.52,1.25 40.87,2.9 38.49,2.9 36.5,0.91 35.08,0.91 34.28,1.71 34.28,3.31 34.05,3.54 U101.11 31.13,3.54 31.13,3.53 29.36,1.76 29.36,1.75 28.52,0.91 26.44,0.91 25.65,1.71 25.65,2.24 25.01,2.88 22.09,2.88 20.34,1.13 15.9,1.13 13.48,3.55 13.48,9.32 12.08,10.72 8.59,10.72 8.08,11.22 v8.08,12.68 13.03,17.63 20.44,17.63 21.72,18.91 24.84,18.91 25.58,18.17 25.58,17.77 26.44,16.91 28.5,16.91 29.29,17.71 29.29,18.01 29.43,18.14 29.43,19.17 29.79,19.53 U100.11 34.18,19.54 34.34,19.37 34.34,17.77 35.14,16.98 36.33,16.98 38.25,18.91 41.84,18.91 43.48,17.27 46.85,17.27 47.43,17.86 47.43,19.4 47.57,19.53 U102.11
S2  (via drill 0.35)
  Top 0.178: U104.2 9.02,11.42 | 9.02,11.42 arc-90 v9.03,11.41 | v9.03,14.72 9.03,11.44 9.02,11.42
  Bottom 0.178: U103.14 38.16,3.54 37.84,3.22 37.84,2.76 36.36,1.27 35.22,1.27 34.64,1.86 34.64,3.9 34.37,4.17 31.26,4.17 29,1.91 29,1.9 28.37,1.27 26.59,1.27 26,1.86 26,2.39 24.88,3.51 23.63,3.51 U101.14 22.25,3.54 20.2,1.48 16.04,1.48 13.88,3.65 13.88,9.48 11.95,11.41 v9.03,11.41 | U102.14 38.38,19.53 36.18,17.33 35.29,17.33 34.7,17.92 34.7,19.86 34.38,20.18 29.39,20.18 28.94,19.72 28.94,17.86 28.35,17.27 26.59,17.27 25.94,17.92 25.94,19.02 25.41,19.54 U100.14 21.84,19.53 20.29,17.99 12.88,17.99 9.61,14.72 v9.03,14.72
S3  (via drill 0.35)
  Top 0.178: U104.3 8.45,10.16 v8.84,9.76 9.68,10.6 9.68,13.33 v9.73,13.38
  Bottom 0.178: U103.13 38.36,2.27 36.65,0.56 34.93,0.56 33.85,1.63 29.73,1.63 29.71,1.61 29.71,1.6 28.67,0.56 26.29,0.56 25.29,1.56 25.29,1.76 24.78,2.27 U101.13 21.98,2.27 20.49,0.77 15.75,0.77 13.12,3.4 13.12,9.06 12.04,10.14 9.22,10.14 v8.84,9.76 | U102.13 38.12,18.27 36.47,16.62 34.99,16.62 34.61,17 31.13,17 30.69,16.56 25.84,16.56 24.91,17.5 24.91,18.08 24.72,18.27 U100.13 21.58,18.27 20.55,17.24 13.46,17.24 v9.73,13.38
SCLK
  Top 0.254: J1.6 4.34,20.95 4.97,21.57 4.97,29.51 5.66,30.2 U106.4

### Text on the board
tPlace: Magnetic Imager Tile | v3 r0 | Dec 2017 | peter jansen | (0,0) | (0,7) | (7,0) | (7,7)
bPlace: GND | AOUT | SCLK | MISO | CS | CLR | CLK | 3.3V